# EAGLE schematic plytka_glowna (EAGLE 7.6.0)
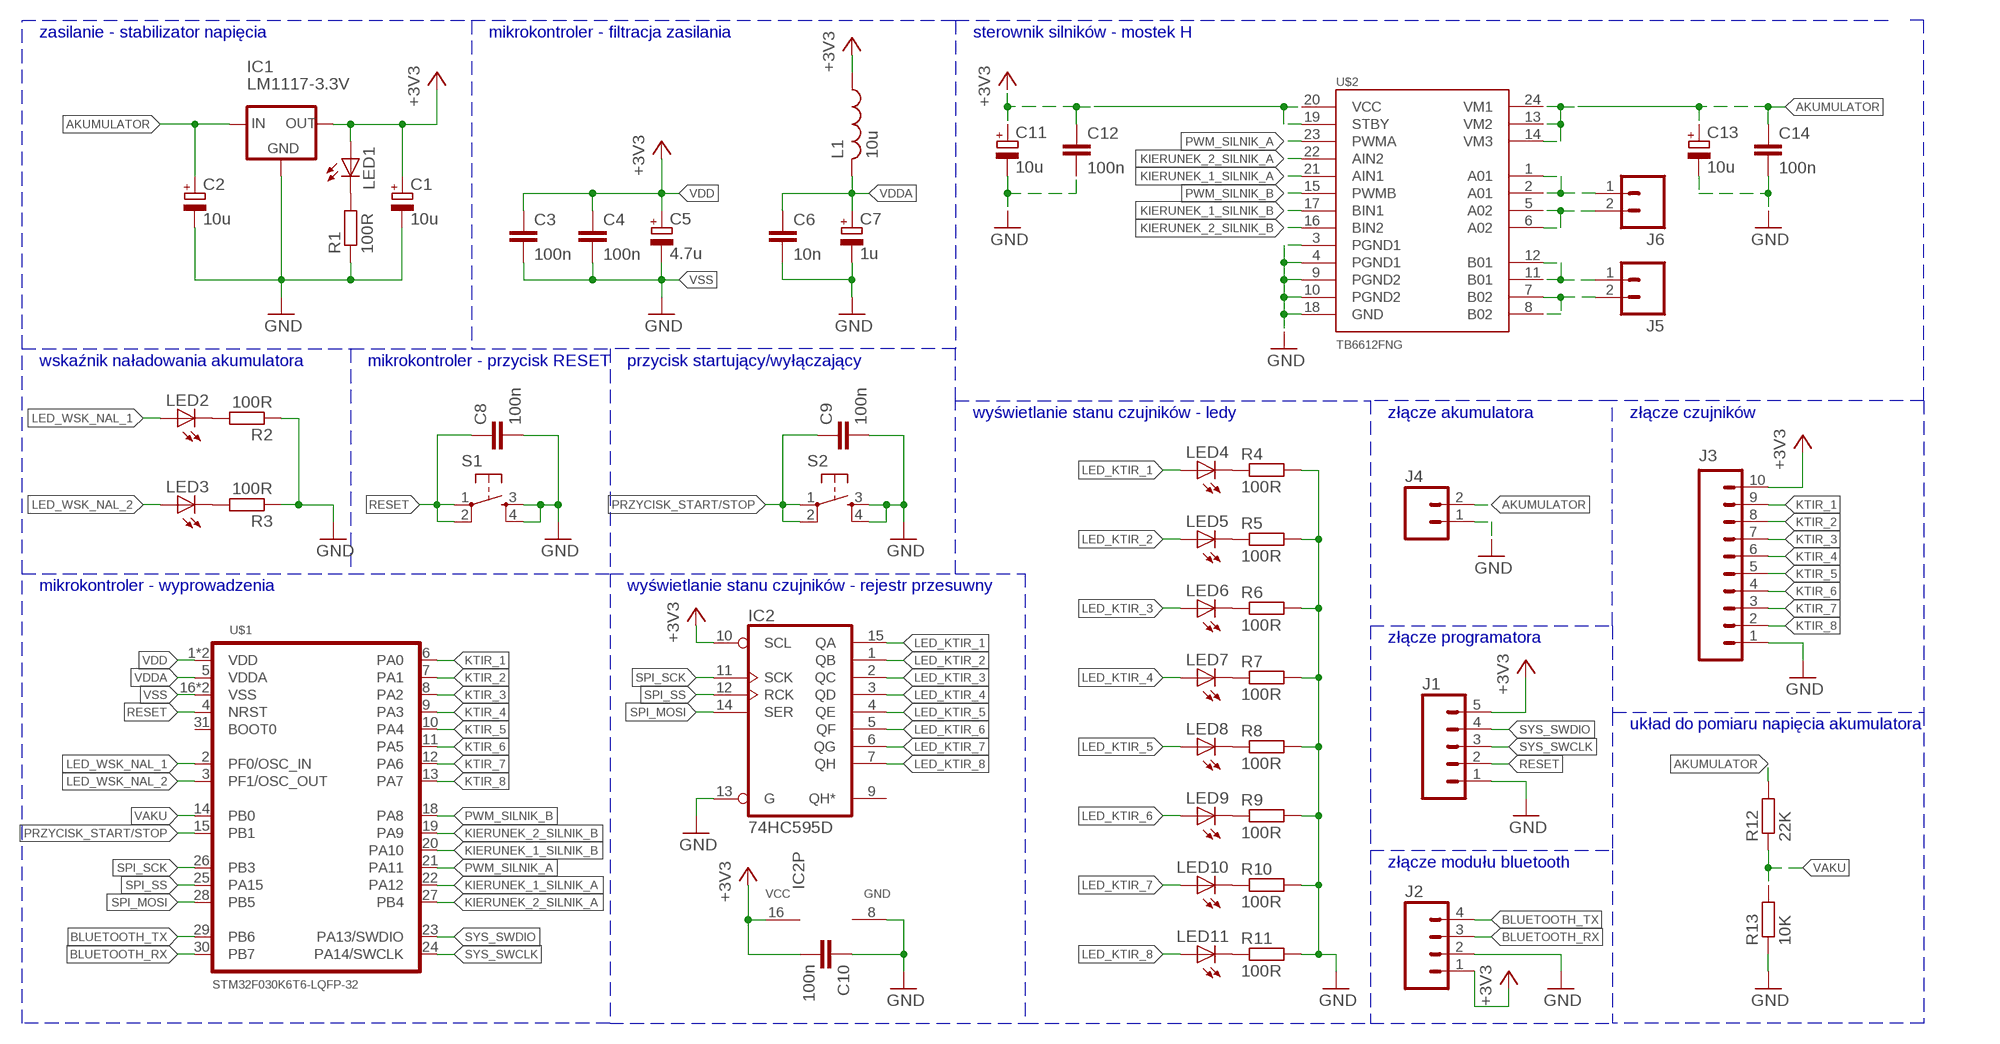
[diagram p0: schematic, sheet 1]

## Parts
C1  10u  CPOL-EU085CS-1AR  [085CS_1AR]
C2  10u  CPOL-EU085CS-1AR  [085CS_1AR]
C3  100n  C-EU025-024X044  [C025-024X044]
C4  100n  C-EU025-024X044  [C025-024X044]
C5  4.7u  CPOL-EU085CS-1AR  [085CS_1AR]
C6  10n  C-EU025-024X044  [C025-024X044]
C7  1u  CPOL-EU085CS-1AR  [085CS_1AR]
C8  100n  C-EU025-024X044  [C025-024X044]
C9  100n  C-EU025-024X044  [C025-024X044]
C10  100n  C-EU025-024X044  [C025-024X044]
C11  10u  CPOL-EU085CS-1AR  [085CS_1AR]
C12  100n  C-EU025-024X044  [C025-024X044]
C13  10u  CPOL-EU085CS-1AR  [085CS_1AR]
C14  100n  C-EU025-024X044  [C025-024X044]
IC1  LM1117-3.3V  LM1117DTX-3.3  [TO252]
IC2  74HC595D  [SO16]
J1  M05LOCK_LONGPADS  [1X05_LOCK_LONGPADS]
J2  M04JST  [1X04-1.5MM_JST]
J3  M10LOCK  [1X10_LOCK]
J4  M02-JST-2-PTH-NO_SILK  [JST-2-PTH-NS]
J5  M02-JST-2-PTH-NO_SILK  [JST-2-PTH-NS]
J6  M02-JST-2-PTH-NO_SILK  [JST-2-PTH-NS]
L1  10u  L-US0204/5  [0204/5]
LED1  LEDCHIP-LED0805  [CHIP-LED0805]
LED2  LEDCHIP-LED0805  [CHIP-LED0805]
LED3  LEDCHIP-LED0805  [CHIP-LED0805]
LED4  LEDCHIP-LED0805  [CHIP-LED0805]
LED5  LEDCHIP-LED0805  [CHIP-LED0805]
LED6  LEDCHIP-LED0805  [CHIP-LED0805]
LED7  LEDCHIP-LED0805  [CHIP-LED0805]
LED8  LEDCHIP-LED0805  [CHIP-LED0805]
LED9  LEDCHIP-LED0805  [CHIP-LED0805]
LED10  LEDCHIP-LED0805  [CHIP-LED0805]
LED11  LEDCHIP-LED0805  [CHIP-LED0805]
R1  100R  R-EU_0204/2V  [0204V]
R2  100R  R-EU_0204/2V  [0204V]
R3  100R  R-EU_0204/2V  [0204V]
R4  100R  R-EU_0204/2V  [0204V]
R5  100R  R-EU_0204/2V  [0204V]
R6  100R  R-EU_0204/2V  [0204V]
R7  100R  R-EU_0204/2V  [0204V]
R8  100R  R-EU_0204/2V  [0204V]
R9  100R  R-EU_0204/2V  [0204V]
R10  100R  R-EU_0204/2V  [0204V]
R11  100R  R-EU_0204/2V  [0204V]
R12  22K  R-EU_0204/2V  [0204V]
R13  10K  R-EU_0204/2V  [0204V]
S1  TACTILE-SWITCH-7914G  [7914G]
S2  TACTILE-SWITCH-7914G  [7914G]
U$1  STM32F030K6T6-LQFP-32  [LQFP-32]
U$2  TB6612FNG  [SSOP24]

## Nets
+3V3: C1.+ C10.2 IC1.TAB(OUT) IC2.10(SCL) IC2.16(VCC) J1.5 J2.1 J3.10 L1.1 LED1.A
AKUMULATOR: C2.+ C13.+ C14.1 IC1.2(IN) J4.2 R12.2 U$2.13(VM2) U$2.14(VM3) U$2.24(VM1)
BLUETOOTH_RX: J2.3 U$1.30(PB7)
BLUETOOTH_TX: J2.4 U$1.29(PB6)
GND: C1.- C2.- C6.2 C7.- C8.2 C9.2 C10.1 C11.- C12.2 C13.- C14.2 IC1.1(GND) IC2.8(GND) IC2.13(G) J1.1 J2.2 J3.1 J4.1 R1.1 R2.1 R3.1 R4.2 R5.2 R6.2 R7.2 R8.2 R9.2 R10.2 R11.2 R13.1 S1.3 S1.4 S2.3 S2.4 U$2.3(PGND1) U$2.4(PGND1) U$2.9(PGND2) U$2.10(PGND2) U$2.18(GND)
KIERUNEK_1_SILNIK_A: U$1.22(PA12) U$2.21(AIN1)
KIERUNEK_1_SILNIK_B: U$1.20(PA10) U$2.17(BIN1)
KIERUNEK_2_SILNIK_A: U$1.27(PB4) U$2.22(AIN2)
KIERUNEK_2_SILNIK_B: U$1.19(PA9) U$2.16(BIN2)
KTIR_1: J3.9 U$1.6(PA0)
KTIR_2: J3.8 U$1.7(PA1)
KTIR_3: J3.7 U$1.8(PA2)
KTIR_4: J3.6 U$1.9(PA3)
KTIR_5: J3.5 U$1.10(PA4)
KTIR_6: J3.4 U$1.11(PA5)
KTIR_7: J3.3 U$1.12(PA6)
KTIR_8: J3.2 U$1.13(PA7)
LED_KTIR_1: IC2.15(QA) LED4.A
LED_KTIR_2: IC2.1(QB) LED5.A
LED_KTIR_3: IC2.2(QC) LED6.A
LED_KTIR_4: IC2.3(QD) LED7.A
LED_KTIR_5: IC2.4(QE) LED8.A
LED_KTIR_6: IC2.5(QF) LED9.A
LED_KTIR_7: IC2.6(QG) LED10.A
LED_KTIR_8: IC2.7(QH) LED11.A
LED_WSK_NAL_1: LED2.A U$1.2(PF0/OSC_IN)
LED_WSK_NAL_2: LED3.A U$1.3(PF1/OSC_OUT)
N$1: LED1.C R1.2
N$2: LED2.C R2.2
N$3: LED3.C R3.2
N$4: LED4.C R4.1
N$5: LED5.C R5.1
N$6: J6.2 U$2.5(A02) U$2.6(A02)
N$7: J5.2 U$2.7(B02) U$2.8(B02)
N$8: LED6.C R6.1
N$9: J5.1 U$2.11(B01) U$2.12(B01)
N$10: LED7.C R7.1
N$11: J6.1 U$2.1(A01) U$2.2(A01)
N$12: LED8.C R8.1
N$14: LED9.C R9.1
N$16: LED10.C R10.1
N$18: LED11.C R11.1
PRZYCISK_START/STOP: C9.1 S2.1 S2.2 U$1.15(PB1)
PWM_SILNIK_A: U$1.21(PA11) U$2.23(PWMA)
PWM_SILNIK_B: U$1.18(PA8) U$2.15(PWMB)
RESET: C8.1 J1.2 S1.1 S1.2 U$1.4(NRST)
SPI_MOSI: IC2.14(SER) U$1.28(PB5)
SPI_SCK: IC2.11(SCK) U$1.26(PB3)
SPI_SS: IC2.12(RCK) U$1.25(PA15)
SYS_SWCLK: J1.3 U$1.24(PA14/SWCLK)
SYS_SWDIO: J1.4 U$1.23(PA13/SWDIO)
TB6612_VCC: C11.+ C12.1 U$2.19(STBY) U$2.20(VCC) ; supply symbol labelled +3V3
VAKU: R12.1 R13.2 U$1.14(PB0)
VDD: C3.1 C4.1 C5.+ U$1.1(VDD) U$1.17(VDD)
VDDA: C6.1 C7.+ L1.2 U$1.5(VDDA)
VSS: C3.2 C4.2 C5.- U$1.16(VSS) U$1.32(VSS) ; supply symbol labelled GND
Unconnected: IC2.9(QH*) U$1.31(BOOT0)

## Buses
B$1

## Notes on the sheet
- zasilanie - stabilizator napięcia | mikrokontroler - filtracja zasilania | sterownik silników - mostek H
- wskaźnik naładowania akumulatora | mikrokontroler - przycisk RESET | przycisk startujący/wyłączający
- wyświetlanie stanu czujników - ledy | złącze akumulatora | złącze czujników
- mikrokontroler - wyprowadzenia | wyświetlanie stanu czujników - rejestr przesuwny
- złącze programatora
- układ do pomiaru napięcia akumulatora
- złącze modułu bluetooth

## Library data of the parts
C1 C2 C5 C7 C11 C13 = rcl:CPOL-EU: POLARIZED CAPACITOR, European symbol
C3 C4 C6 C8-C10 C12 C14 = rcl:C-EU: CAPACITOR, European symbol
IC1 = lm1117:LM1117DTX-*
IC2 = 74xx-eu:74*595: 8-bit SHIFT REGISTER, output latch
J1 = SparkFun-Connectors:M05: Header 5 Standard 5-pin 0.1" header. Use with straight break away headers (SKU : PRT-00116), right angle break away headers (PRT-00553), swiss pins (PRT-00743), machine pins (PRT-00117), and female headers (PRT-00115). Molex polarized connector foot print use with SKU : PRT-08230 with associated crimp pins and housings.
J2 = SparkFun-Connectors:M04: Header 4 Standard 4-pin 0.1" header. Use with straight break away headers (SKU : PRT-00116), right angle break away headers (PRT-00553), swiss pins (PRT-00743), machine pins (PRT-00117), and female headers (PRT-00115). Molex polarized connector foot print use with SKU : PRT-08231 with associated crimp pins and housings. 1MM SMD Version SKU: PRT-10208; PROD_ID: CONN-12477
J3 = SparkFun-Connectors:M10: Header 10 Standard 10-pin 0.1" header. Use with straight break away headers (SKU : PRT-00116), right angle break away headers (PRT-00553), swiss pins (PRT-00743), machine pins (PRT-00117), and female headers (PRT-00115).
J4-J6 = SparkFun-Connectors:M02: Standard 2-pin 0.1" header. Use with - straight break away headers ( PRT-00116) - right angle break away headers (PRT-00553) - swiss pins (PRT-00743) - machine pins (PRT-00117) - female headers (PRT-00115) Molex polarized connector foot print use with: PRT-08233 with associated crimp pins and housings. 2.54_SCREWTERM for use with PRT-10571. 3.5mm Screw Terminal footprints for PRT-08084 5mm Screw Terminal footprints for use with PRT-08432
L1 = rcl:L-US: INDUCTOR, American symbol
LED1-LED11 = led:LED: LED OSRAM: - CHIPLED LG R971, LG N971, LY N971, LG Q971, LY Q971, LO R971, LY R971 LH N974, LH R974 LS Q976, LO Q976, LY Q976 LO Q996 - Hyper CHIPLED LW Q18S LB Q993, LB Q99A, LB R99A - SideLED LS A670, LO A670, LY A670, LG A670, LP A670 LB A673, LV A673, LT A673, LW A673 LH A674 LY A675 LS A676, LA A676, LO A676, LY A676, LW A676 LS A679, LY A679, LG A679 - Hyper Micro SIDELED® LS Y876, LA Y876, LO Y876, LY Y876 LT Y87S - SmartLED LW L88C, LW L88S LB L89C, LB L89S, LG L890 LS L89K, LO L89K, LY L89K LS L896, LA L896, LO L896, LY L896 - TOPLED LS T670, LO T670, LY T670, LG T670, LP T670 LSG T670, LSP T670, LSY T670, LOP T670, LYG T670 LG T671, LOG T671, LSG T671 LB T673, LV T673, LT T673, LW T673 LH T674 LS T676, LA T676, LO T676, LY T676, LB T676, LH T676, LSB T676, LW T676 LB T67C, LV T67C, LT T67C, LS T67K, LO T67K, LY T67K, LW E67C LS E67B, LA E67B, LO E67B, LY E67B, LB E67C, LV E67C, LT E67C LW T67C LS T679, LY T679, LG T679 LS T770, LO T770, LY T770, LG T770, LP T770 LB T773, LV T773, LT T773, LW T773 LH T774 LS E675, LA E675, LY E675, LS T675 LS T776, LA T776, LO T776, LY T776, LB T776 LHGB T686 LT T68C, LB T68C - Hyper Mini TOPLED® LB M676 - Mini TOPLED Santana® LG M470 LS M47K, LO M47K, LY M47K Source: http://www.osram.convergy.de LUXEON: - LUMILED® LXK2-PW12-R00, LXK2-PW12-S00, LXK2-PW14-U00, LXK2-PW14-V00 LXK2-PM12-R00, LXK2-PM12-S00, LXK2-PM14-U00 LXK2-PE12-Q00, LXK2-PE12-R00, LXK2-PE12-S00, LXK2-PE14-T00, LXK2-PE14-U00 LXK2-PB12-K00, LXK2-PB12-L00, LXK2-PB12-M00, LXK2-PB14-N00, LXK2-PB14-P00, LXK2-PB14-Q00 LXK2-PR12-L00, LXK2-PR12-M00, LXK2-PR14-Q00, LXK2-PR14-R00 LXK2-PD12-Q00, LXK2-PD12-R00, LXK2-PD12-S00 LXK2-PH12-R00, LXK2-PH12-S00 LXK2-PL12-P00, LXK2-PL12-Q00, LXK2-PL12-R00 Source: www.luxeon.com KINGBRIGHT: KA-3528ASYC Source: www.kingbright.com
R1-R13 = rcl:R-EU_: RESISTOR, European symbol
S1 S2 = GeekAmmo:TACTILE-SWITCH: Tactile Switch 4 Pins, SPST NO
U$1 = STM32F030K6T6:STM32F030K6T6
U$2 = SparkFun-PowerIC:TB6612FNG: Toshiba 1A dual motor driver IC-09363; PROD_ID: IC-09363